# Altium schematic sheet power.SchDoc
size A4; SheetNumber: 1; SheetTotal: 2
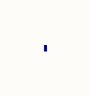
[diagram p0: power.SchDoc]